# EAGLE design ioboard (EAGLE 9.6.2)
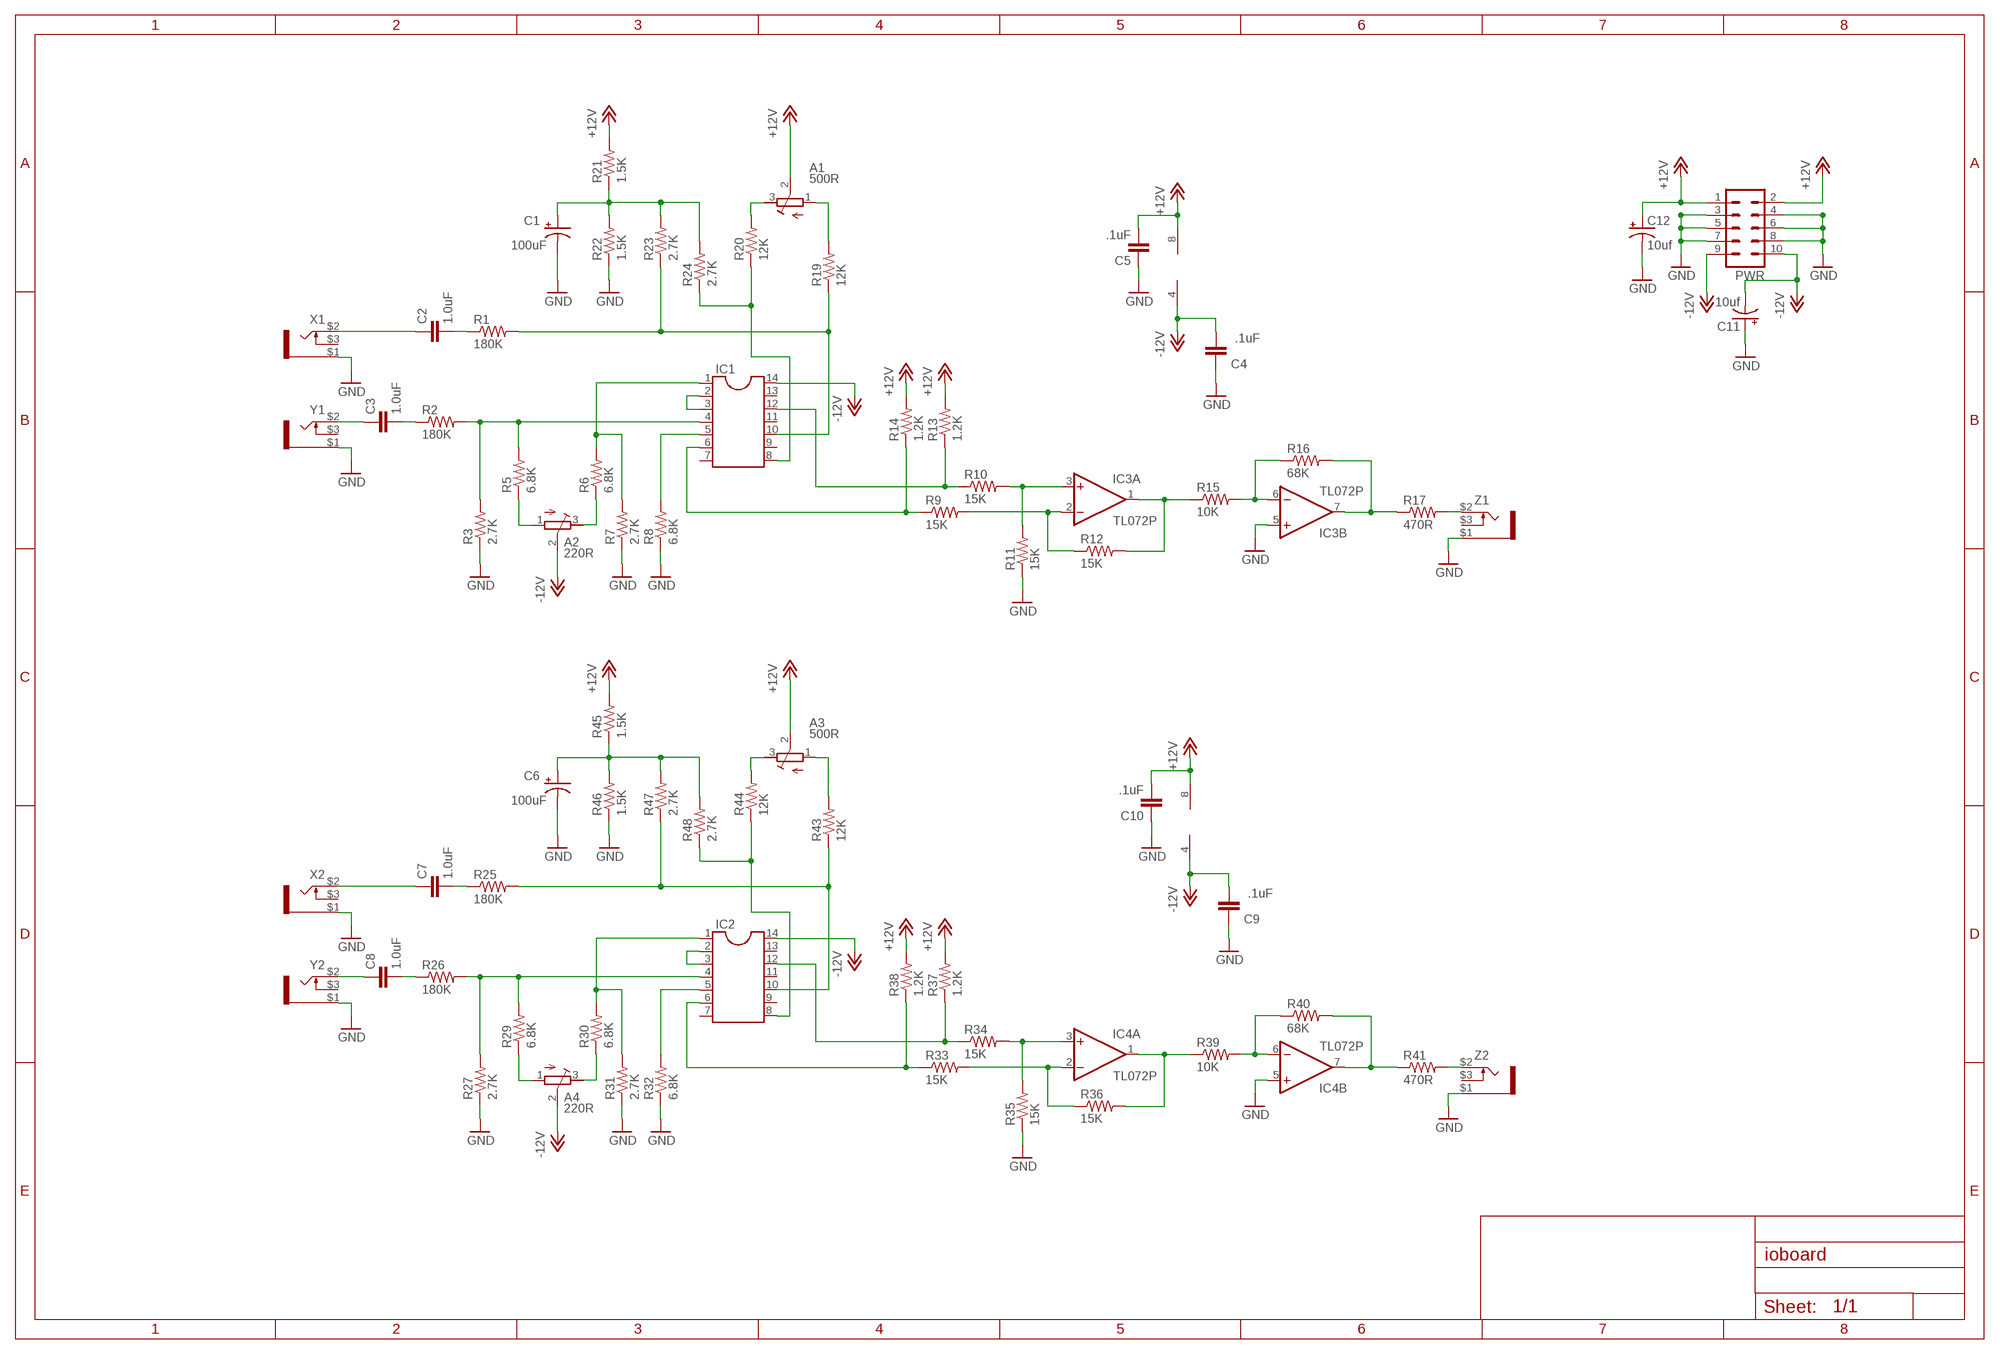
[diagram p0: schematic, sheet 1]

## Parts
A1  500R  R-TRIMM3296W  [RTRIM3296W]
A2  220R  R-TRIMM3296W  [RTRIM3296W]
A3  500R  R-TRIMM3296W  [RTRIM3296W]
A4  220R  R-TRIMM3296W  [RTRIM3296W]
C1  100uF  CPOL-USE2.5-6  [E2,5-6]
C2  1.0uF  C-EU050-024X044  [C050-024X044]
C3  1.0uF  C-EU050-024X044  [C050-024X044]
C4  .1uF  C-EU050-024X044  [C050-024X044]
C5  .1uF  C-EU050-024X044  [C050-024X044]
C6  100uF  CPOL-USE2.5-6  [E2,5-6]
C7  1.0uF  C-EU050-024X044  [C050-024X044]
C8  1.0uF  C-EU050-024X044  [C050-024X044]
C9  .1uF  C-EU050-024X044  [C050-024X044]
C10  .1uF  C-EU050-024X044  [C050-024X044]
C11  10uf  CPOL-USE2.5-5  [E2,5-5]
C12  10uf  CPOL-USE2.5-5  [E2,5-5]
IC1  LM1496  [LM1496]
IC2  LM1496  [LM1496]
IC3  TL072P  [DIL08]
IC4  TL072P  [DIL08]
PWR  ML10  [ML10]
R1  180K  R-US_0207/7  [0207/7]
R2  180K  R-US_0207/7  [0207/7]
R3  2.7K  R-US_0207/7  [0207/7]
R5  6.8K  R-US_0207/7  [0207/7]
R6  6.8K  R-US_0207/7  [0207/7]
R7  2.7K  R-US_0207/7  [0207/7]
R8  6.8K  R-US_0207/7  [0207/7]
R9  15K  R-US_0207/7  [0207/7]
R10  15K  R-US_0207/7  [0207/7]
R11  15K  R-US_0207/7  [0207/7]
R12  15K  R-US_0207/7  [0207/7]
R13  1.2K  R-US_0207/7  [0207/7]
R14  1.2K  R-US_0207/7  [0207/7]
R15  10K  R-US_0207/7  [0207/7]
R16  68K  R-US_0207/7  [0207/7]
R17  470R  R-US_0207/7  [0207/7]
R19  12K  R-US_0207/7  [0207/7]
R20  12K  R-US_0207/7  [0207/7]
R21  1.5K  R-US_0207/7  [0207/7]
R22  1.5K  R-US_0207/7  [0207/7]
R23  2.7K  R-US_0207/7  [0207/7]
R24  2.7K  R-US_0207/7  [0207/7]
R25  180K  R-US_0207/7  [0207/7]
R26  180K  R-US_0207/7  [0207/7]
R27  2.7K  R-US_0207/7  [0207/7]
R29  6.8K  R-US_0207/7  [0207/7]
R30  6.8K  R-US_0207/7  [0207/7]
R31  2.7K  R-US_0207/7  [0207/7]
R32  6.8K  R-US_0207/7  [0207/7]
R33  15K  R-US_0207/7  [0207/7]
R34  15K  R-US_0207/7  [0207/7]
R35  15K  R-US_0207/7  [0207/7]
R36  15K  R-US_0207/7  [0207/7]
R37  1.2K  R-US_0207/7  [0207/7]
R38  1.2K  R-US_0207/7  [0207/7]
R39  10K  R-US_0207/7  [0207/7]
R40  68K  R-US_0207/7  [0207/7]
R41  470R  R-US_0207/7  [0207/7]
R43  12K  R-US_0207/7  [0207/7]
R44  12K  R-US_0207/7  [0207/7]
R45  1.5K  R-US_0207/7  [0207/7]
R46  1.5K  R-US_0207/7  [0207/7]
R47  2.7K  R-US_0207/7  [0207/7]
R48  2.7K  R-US_0207/7  [0207/7]
X1  PJ-323PJ-323  [PJ-323]
X2  PJ-323PJ-323  [PJ-323]
Y1  PJ-323PJ-323  [PJ-323]
Y2  PJ-323PJ-323  [PJ-323]
Z1  PJ-323PJ-323  [PJ-323]
Z2  PJ-323PJ-323  [PJ-323]

## Nets
+12V: A1.2(S) A3.2(S) C5.2 C10.2 C12.+ IC3.8(P:V+) IC4.8(P:V+) PWR.1 PWR.2 R13.2 R14.2 R21.2 R37.2 R38.2 R45.2
-12V: A2.2(S) A4.2(S) C4.2 C9.2 C11.- IC1.14 IC2.14 IC3.4(P:V-) IC4.4(P:V-) PWR.9 PWR.10
GND: C1.- C4.1 C5.1 C6.- C9.1 C10.1 C11.+ C12.- IC3.5(B:+IN) IC4.5(B:+IN) PWR.3 PWR.4 PWR.5 PWR.6 PWR.7 PWR.8 R3.1 R7.1 R8.1 R11.1 R22.1 R27.1 R31.1 R32.1 R35.1 R46.1 X1.$1 X2.$1 Y1.$1 Y2.$1 Z1.$1 Z2.$1
N$1: C2.1 X1.$2
N$2: C3.1 Y1.$2
N$3: C2.2 R1.1
N$4: C3.2 R2.1
N$5: IC1.2 IC1.3
N$6: IC1.4 R2.2 R3.2 R5.2
N$7: C1.+ R21.1 R22.2 R23.2 R24.2
N$8: A2.1(A) R5.1
N$9: IC1.1 R6.2 R7.2
N$10: A2.3(E) R6.1
N$11: IC1.5 R8.2
N$12: IC1.6 R9.1 R14.1
N$13: IC3.2(A:-IN) R9.2 R12.1
N$14: IC1.12 R10.1 R13.1
N$15: IC3.3(A:+IN) R10.2 R11.2
N$16: IC3.1(A:OUT) R12.2 R15.1
N$17: IC3.6(B:-IN) R15.2 R16.1
N$18: R17.2 Z1.$2
N$19: IC3.7(B:OUT) R16.2 R17.1
N$20: A1.3(E) R20.2
N$21: IC1.8 R20.1 R24.1
N$22: A1.1(A) R19.2
N$23: IC1.10 R1.2 R19.1 R23.1
N$24: C7.1 X2.$2
N$25: C8.1 Y2.$2
N$26: C7.2 R25.1
N$27: C8.2 R26.1
N$28: IC2.2 IC2.3
N$29: IC2.4 R26.2 R27.2 R29.2
N$30: A4.1(A) R29.1
N$31: IC2.1 R30.2 R31.2
N$32: A4.3(E) R30.1
N$33: IC2.5 R32.2
N$34: IC2.6 R33.1 R38.1
N$35: IC4.2(A:-IN) R33.2 R36.1
N$36: IC2.12 R34.1 R37.1
N$37: IC4.3(A:+IN) R34.2 R35.2
N$38: IC4.1(A:OUT) R36.2 R39.1
N$39: IC4.6(B:-IN) R39.2 R40.1
N$40: IC4.7(B:OUT) R40.2 R41.1
N$41: R41.2 Z2.$2
N$42: IC2.8 R44.1 R48.1
N$43: A3.1(A) R43.2
N$44: A3.3(E) R44.2
N$45: IC2.10 R25.2 R43.1 R47.1
N$46: C6.+ R45.1 R46.2 R47.2 R48.2
Unconnected: IC1.7 IC1.9 IC1.11 IC1.13 IC2.7 IC2.9 IC2.11 IC2.13 X1.$3 X2.$3 Y1.$3 Y2.$3 Z1.$3 Z2.$3

## Library data of the parts
A1-A4 = resistor:R-TRIMM: Trimm resistor
C1 C6 C11 C12 = resistor:CPOL-US: POLARIZED CAPACITOR, American symbol
C2-C5 C7-C10 = resistor:C-EU: CAPACITOR, European symbol
IC1 IC2 = gerbster:LM1496: Dual In Line / Socket
IC3 IC4 = TomW:TL072: OP AMP
PWR = con-ml:ML10: HARTING; OC_FARNELL: unknown; OC_NEWARK: unknown
R1-R3 R5-R17 R19-R27 R29-R41 R43-R48 = resistor:R-US_: RESISTOR, American symbol
X1 X2 Y1 Y2 Z1 Z2 = gerbster:PJ-323

## Board
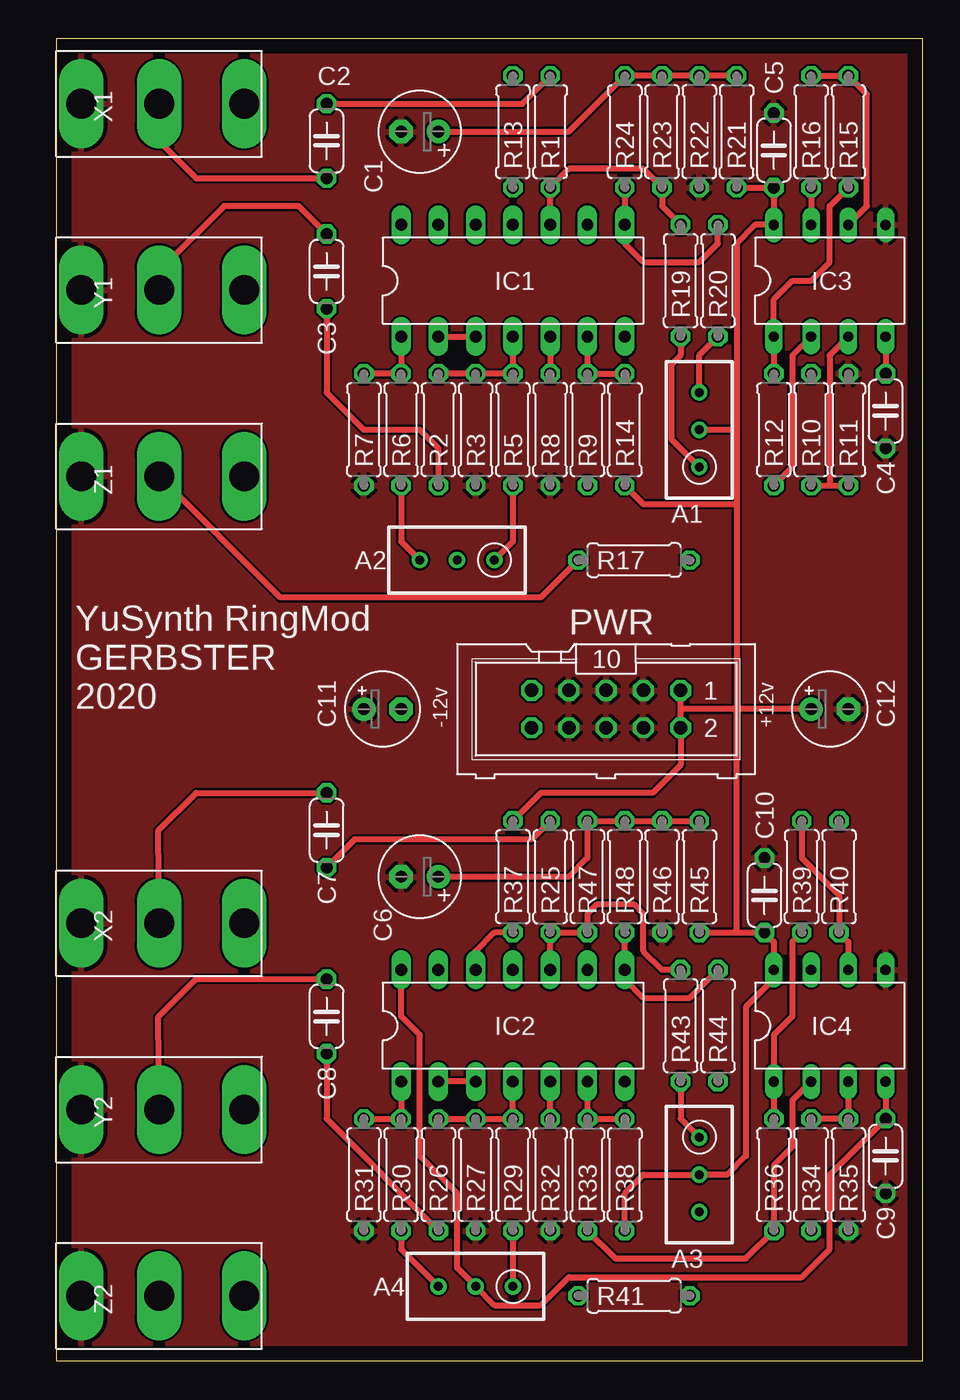
[diagram p1: board, top side]
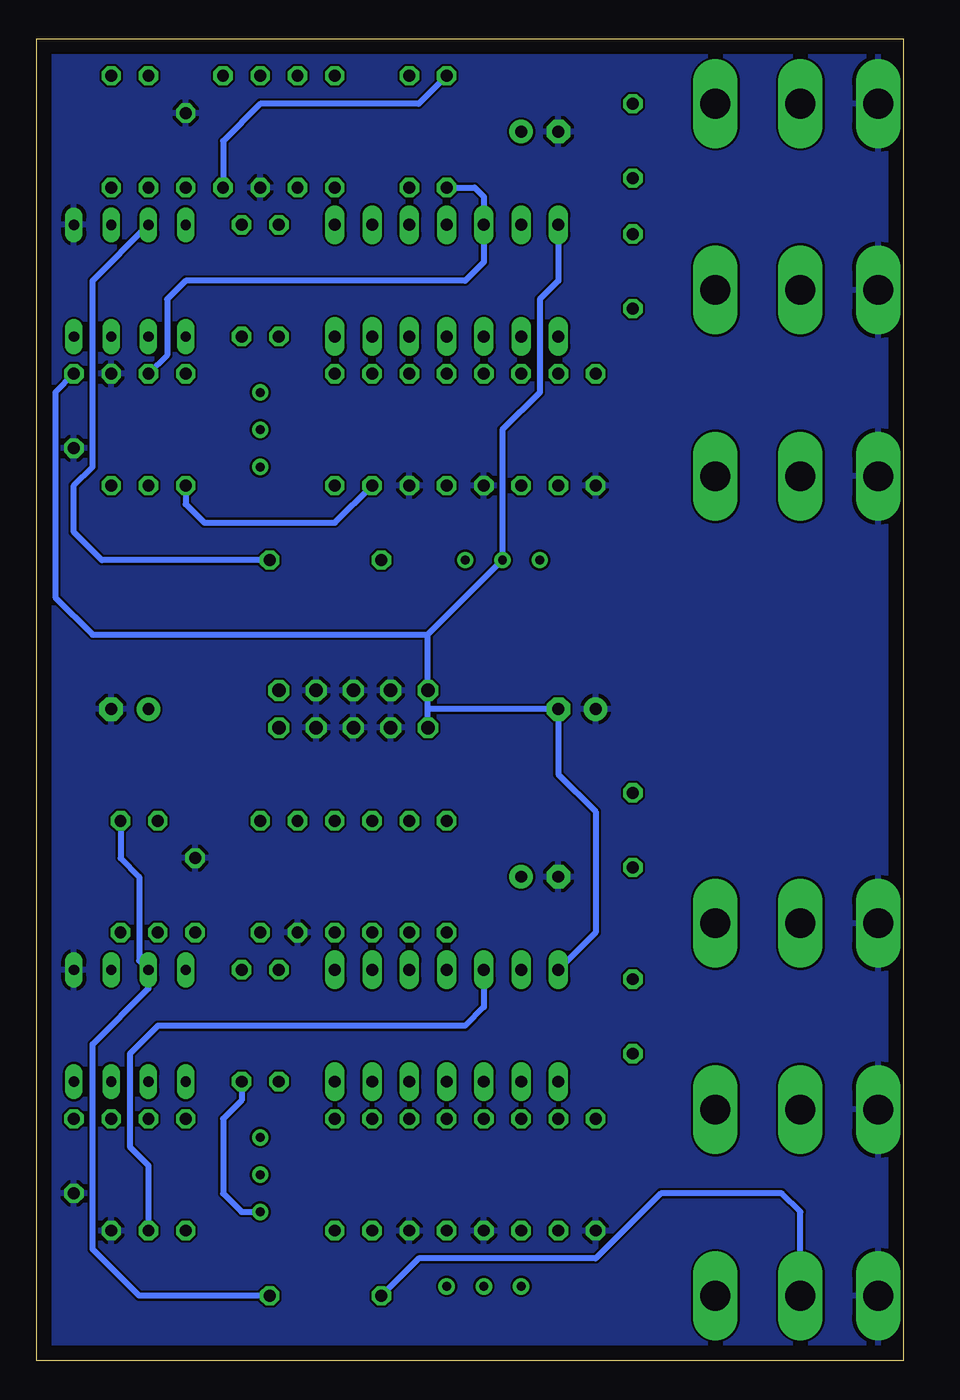
[diagram p2: board, bottom side, seen from below]

Size 59.05 x 90.17 mm. Coordinates in mm from the lower left corner, seen from the top.
Outline: 0,0 59.05,0 59.05,90.17 0,90.16 0,0
Copper layers (1*16): Top 0.035mm / dielectric 1.5mm / Bottom 0.035mm
Design rules "default": minimum track width 6mil, minimum drill 0.35mm, track to track 6mil, track to pad 6mil, pad to pad 6mil, via to via 6mil, smd to smd 6mil, copper to edge 40mil, drill to drill 6mil, minimum pad ring 10mil, minimum via ring 8mil, stop-mask expansion 4mil, vias tented up to drill 0mil, thermal gap 10mil

### Footprints (pad centres in the part's own frame; a part is rotated, then mirrored left to right if it is on the bottom)
RTRIM3296W = drill 0.61: 1 0,-2.54; 2 0,0; 3 0,2.54
E2,5-6 = drill 0.813 pad 1.6: + -1.27,0 | drill 0.813 pad 1.6 octagon: - 1.27,0
C050-024X044 = drill 0.813 octagon: 1 -2.54,0; 2 2.54,0
E2,5-5 = drill 0.813 pad 1.6: + -1.27,0 | drill 0.813 pad 1.6 octagon: - 1.27,0
LM1496 = drill 0.813 long: 1 -7.62,-3.81; 2 -5.08,-3.81; 3 -2.54,-3.81; 4 0,-3.81; 5 2.54,-3.81; 6 5.08,-3.81; 7 7.62,-3.81; 8 7.62,3.81; 9 5.08,3.81; 10 2.54,3.81; 11 0,3.81; 12 -2.54,3.81; 13 -5.08,3.81; 14 -7.62,3.81
DIL08 = drill 0.7 long: 1 -3.81,-3.81; 2 -1.27,-3.81; 3 1.27,-3.81; 4 3.81,-3.81; 5 3.81,3.81; 6 1.27,3.81; 7 -1.27,3.81; 8 -3.81,3.81
ML10 = drill 0.914 octagon: 1 -5.08,-1.27; 2 -5.08,1.27; 3 -2.54,-1.27; 4 -2.54,1.27; 5 0,-1.27; 6 0,1.27; 7 2.54,-1.27; 8 2.54,1.27; 9 5.08,-1.27; 10 5.08,1.27
0207/7 = drill 0.813 octagon: 1 -3.81,0; 2 3.81,0
PJ-323 = drill 2.032 pad 2.54 long: $1 0,-1.7; $2 0,-7; $3 0,-12.8

### Placement (x,y rotation side)
A1  43.81,63.5 0 top
A2  27.3,54.61 90 top
A3  43.81,12.7 180 top
A4  28.57,5.08 90 top
C1  24.77,83.82 180 top
C2  18.41,83.19 90 top
C3  18.41,74.3 270 top
C4  56.52,64.77 90 top
C5  48.9,82.55 270 top
C6  24.77,33.02 180 top
C7  18.41,36.2 270 top
C8  18.41,23.5 270 top
C9  56.52,13.97 90 top
C10  48.26,31.75 270 top
C11  22.23,44.45 0 top
C12  52.7,44.45 0 top
IC1  31.11,73.66 0 top
IC2  31.11,22.86 0 top
IC3  52.7,73.66 0 top
IC4  52.7,22.86 0 top
PWR  37.47,44.45 180 top
R1  33.66,83.82 270 top
R2  26.04,63.5 90 top
R3  28.57,63.5 90 top
R5  31.11,63.5 90 top
R6  23.5,63.5 90 top
R7  20.95,63.5 90 top
R8  33.66,63.5 90 top
R9  36.2,63.5 270 top
R10  51.44,63.5 270 top
R11  53.98,63.5 270 top
R12  48.9,63.5 90 top
R13  31.11,83.82 90 top
R14  38.73,63.5 270 top
R15  53.98,83.82 90 top
R16  51.44,83.82 270 top
R17  39.37,54.61 180 top
R19  42.55,73.66 270 top
R20  45.09,73.66 270 top
R21  46.35,83.82 270 top
R22  43.81,83.82 90 top
R23  41.27,83.82 90 top
R24  38.73,83.82 90 top
R25  33.66,33.02 270 top
R26  26.04,12.7 90 top
R27  28.57,12.7 90 top
R29  31.11,12.7 90 top
R30  23.5,12.7 90 top
R31  20.95,12.7 90 top
R32  33.66,12.7 90 top
R33  36.2,12.7 270 top
R34  51.44,12.7 90 top
R35  53.98,12.7 90 top
R36  48.9,12.7 90 top
R37  31.11,33.02 90 top
R38  38.73,12.7 270 top
R39  50.8,33.02 90 top
R40  53.34,33.02 90 top
R41  39.37,4.45 180 top
R43  42.55,22.86 270 top
R44  45.09,22.86 270 top
R45  43.81,33.02 270 top
R46  41.27,33.02 90 top
R47  36.2,33.02 90 top
R48  38.73,33.02 90 top
X1  0,85.72 90 top
X2  0,29.84 90 top
Y1  0,73.03 90 top
Y2  0,17.14 90 top
Z1  0,60.33 90 top
Z2  0,4.45 90 top

### Tracks (layer width: path | path; a pad name or v marks a point on that pad's centre or on a via)
+12V
  Top 0.406: R21.2 C5.2 IC3.8 47.62,77.47 46.35,76.2 46.35,63.5 | A1.2 46.35,63.5 | 46.35,63.5 46.35,58.42 | R14.2 40.01,58.42 46.35,58.42 | 42.55,44.45 PWR.2 42.55,40.64 40.64,38.73 33.02,38.73 R37.2 | 42.55,44.45 PWR.1 | C12.+ 46.35,44.45 | 46.35,44.45 42.55,44.45 | 46.35,44.45 46.35,29.21 R45.2 C10.2 48.9,28.57 IC4.8 48.9,26.04 46.99,24.13 46.99,13.97 45.72,12.7 A3.2 40.01,12.7 38.73,11.43 R38.2 | 46.35,58.42 46.35,44.45
  Bottom 0.406: R13.2 33.02,85.72 43.81,85.72 46.35,83.19 R21.2
-12V
  Top 0.406: IC3.4 C4.2 | IC4.4 C9.2 52.7,12.7 52.7,7.62 50.8,5.71 34.92,5.71 33.02,3.81 29.84,3.81 A4.2 27.3,6.35 27.3,11.43 24.77,13.97 24.77,22.23 23.5,23.5 IC2.14
  Bottom 0.406: IC1.14 23.5,73.66 24.77,72.39 24.77,66.04 27.3,63.5 A2.2 32.38,49.53 | 32.38,44.45 C11.- 23.5,40.01 20.95,37.47 20.95,29.21 IC2.14 | 32.38,44.45 PWR.9 32.38,49.53 | PWR.10 32.38,44.45 | C4.2 57.78,66.04 57.78,52.07 55.24,49.53 32.38,49.53
GND
  pour Bottom: 0,90.17 59.05,90.17 59.05,0 0,0
  pour Top: 0,90.17 59.05,90.17 59.05,0 0,0
N$1
  Top 0.406: X1.$2 6.98,83.19 9.53,80.64 C2.1
N$2
  Top 0.406: Y1.$2 7,74.28 6.99,74.3 11.43,78.74 16.51,78.74 C3.1
N$3
  Top 0.406: C2.2 31.75,85.72 R1.1
N$4
  Top 0.406: C3.2 18.41,66.04 20.95,63.5 24.77,63.5 26.04,62.23 R2.1
N$5
  Top 0.406: IC1.2 IC1.3
N$6
  Top 0.406: IC1.4 R5.2 R3.2 R2.2
N$7
  Top 0.406: R21.1 R22.2 R23.2 R24.2 34.92,83.82 C1.+
N$8
  Top 0.406: R5.1 31.11,55.88 A2.1
N$9
  Top 0.406: IC1.1 R6.2 R7.2
N$10
  Top 0.406: R6.1 23.5,55.88 A2.3
N$11
  Top 0.406: IC1.5 R8.2
N$12
  Top 0.406: IC1.6 R9.1 R14.1
N$13
  Top 0.406: IC3.2 50.16,68.58 50.16,60.96 R12.1
  Bottom 0.406: R12.1 48.9,58.42 47.62,57.15 38.73,57.15 R9.2
N$14
  Bottom 0.406: R10.1 50.16,68.58 50.16,72.39 48.9,73.66 29.84,73.66 28.57,74.93 IC1.12 28.57,79.38 29.21,80.01 R13.1
N$15
  Top 0.406: R10.2 52.7,59.69 | 52.7,59.69 R11.2 | IC3.3 52.7,68.58 52.7,59.69
N$16
  Top 0.406: R12.2 IC3.1 48.9,72.39 50.16,73.66 51.44,73.66 52.7,74.93 52.7,78.74 R15.1
N$17
  Top 0.406: R16.1 R15.2 55.24,86.36 55.24,78.74 IC3.6
N$18
  Top 0.406: R17.2 33.02,52.07 15.26,52.07 Z1.$2
N$19
  Top 0.406: R16.2 IC3.7
  Bottom 0.406: R17.1 54.61,54.61 56.52,56.52 56.52,59.69 55.24,60.96 55.24,73.66 IC3.7
N$20
  Top 0.406: A1.3 43.81,68.58 R20.2
N$21
  Top 0.406: R24.1 IC1.8 38.73,76.2 40.01,74.93 43.81,74.93 45.09,76.2 R20.1
N$22
  Top 0.406: R19.2 42.55,68.58 41.91,67.94 41.91,62.87 A1.1
N$23
  Top 0.406: IC1.10 R1.2 34.92,81.28 40.01,81.28 R23.1 41.27,78.74 R19.1
N$24
  Top 0.406: X2.$2 6.95,36.16 9.53,38.73 C7.1
N$25
  Top 0.406: Y2.$2 6.95,23.46 9.53,26.04 C8.1
N$26
  Top 0.406: R25.1 32.38,35.56 20.32,35.56 C7.2
N$27
  Top 0.406: C8.2 18.41,16.51 R26.1
N$28
  Top 0.406: IC2.3 IC2.2
N$29
  Top 0.406: R26.2 R27.2 R29.2 IC2.4
N$30
  Top 0.406: R29.1 A4.1
N$31
  Top 0.406: IC2.1 R30.2 R31.2
N$32
  Top 0.406: R30.1 23.5,7.62 A4.3
N$33
  Top 0.406: R32.2 IC2.5
N$34
  Top 0.406: IC2.6 R33.1 R38.1
N$35
  Top 0.406: IC4.2 50.16,17.78 50.16,14.61 48.9,13.34 R36.1 46.99,6.99 38.1,6.99 R33.2
N$36
  Top 0.406: R37.1 29.84,29.21 28.57,27.94 IC2.12
  Bottom 0.406: IC2.12 28.57,24.13 29.84,22.86 50.8,22.86 52.7,20.95 52.7,14.61 51.44,13.34 R34.1
N$37
  Top 0.406: IC4.3 R35.2 R34.2
N$38
  Top 0.406: R39.1 50.16,28.57 50.16,23.5 48.9,22.23 IC4.1 R36.2
N$39
  Top 0.406: IC4.6 53.98,28.57 R40.1 53.34,31.75 50.8,34.29 R39.2
N$40
  Bottom 0.406: R40.2 53.34,34.29 52.07,33.02 52.07,27.3 IC4.7 51.44,25.4 55.24,21.59 55.24,7.62 52.07,4.45 R41.1
N$41
  Bottom 0.406: Z2.$2 7,10.14 6.99,10.16 8.26,11.43 16.51,11.43 20.95,6.99 33.02,6.99 R41.2
N$42
  Top 0.406: R48.1 IC2.8 38.73,26.04 40.01,24.77 43.18,24.77 R44.1
N$43
  Top 0.406: R43.2 42.55,16.51 A3.1
N$44
  Bottom 0.406: R44.2 45.09,17.78 46.35,16.51 46.35,11.43 45.09,10.16 A3.3
N$45
  Top 0.406: IC2.10 R25.2 R47.1 36.2,30.48 36.83,31.11 39.37,31.11 40.01,30.48 40.01,27.94 41.27,26.67 R43.1
N$46
  Top 0.406: R45.1 R46.2 R48.2 R47.2 36.2,34.29 34.92,33.02 C6.+

### Text on the board
tNames: YuSynth RingMod / GERBSTER / 2020 | -12v | +12v